# EAGLE design EEG1CH (EAGLE 9.4.2)
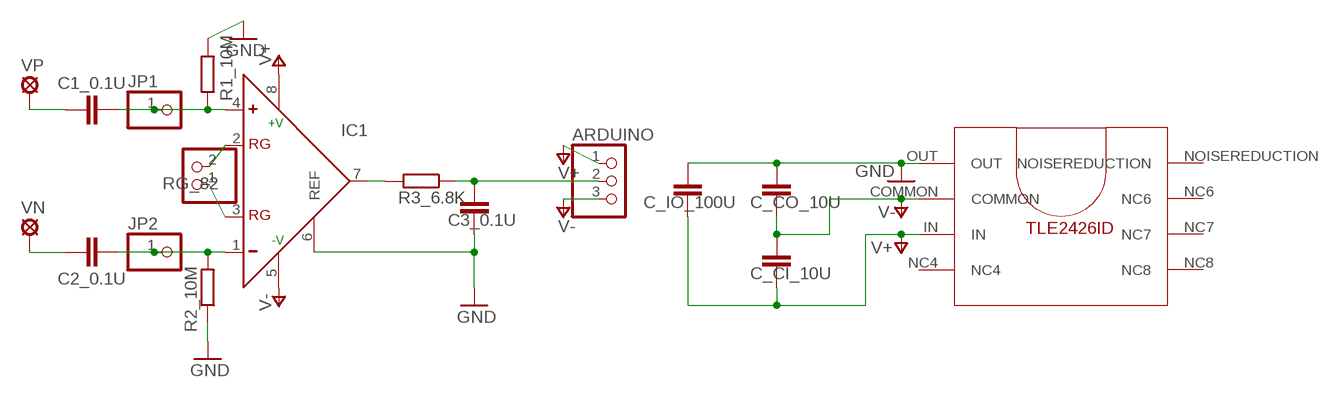
[diagram p0: schematic, sheet 1]

## Parts
ARDUINO  PINHD-1X3  [1X03]
C1_0.1U  C2,5-3  [C2.5-3]
C2_0.1U  C2,5-3  [C2.5-3]
C3_0.1U  C2,5-3  [C2.5-3]
C_CI_10U  C2,5-3  [C2.5-3]
C_CO_10U  C2,5-3  [C2.5-3]
C_IO_100U  C2,5-3  [C2.5-3]
IC1  AD8227  [SO8]
JP1  PINHD-1X1  [1X01]
JP2  PINHD-1X1  [1X01]
R1_10M  R-EU_R2012  [R2012]
R2_10M  R-EU_R2012  [R2012]
R3_6.8K  R-EU_R2012  [R2012]
RG_82  PINHD-1X2  [1X02]
U$1  TLE2426ID  [TLE2426ID]
VN  SE13  [SE13]
VP  SE13  [SE13]

## Nets
GND: C3_0.1U.2 C_CO_10U.1 C_IO_100U.1 IC1.6(REF) R1_10M.2 R2_10M.1 U$1.OUT
N$3: IC1.2(RG) RG_82.2
N$4: IC1.3(RG) RG_82.1
OUT-C-R: IC1.7(OUT) R3_6.8K.2
R-C-IN: C2_0.1U.2 IC1.1(-) JP2.1 R2_10M.2
R-C-IN2: C1_0.1U.2 IC1.4(+) JP1.1 R1_10M.1
R-VO: ARDUINO.2 C3_0.1U.1 R3_6.8K.1
V+: ARDUINO.1 C_CI_10U.2 C_IO_100U.2 IC1.8(+V) U$1.IN
V-: ARDUINO.3 C_CI_10U.1 C_CO_10U.2 IC1.5(-V) U$1.COMMON
VN-C: C2_0.1U.1 VN.MP
VP-C: C1_0.1U.1 VP.MP
Unconnected: U$1.NC4 U$1.NC6 U$1.NC7 U$1.NC8 U$1.NOISEREDUCTION

## Library data of the parts
ARDUINO = pinhead:PINHD-1X3: PIN HEADER
C1_0.1U C2_0.1U C3_0.1U C_CI_10U C_CO_10U C_IO_100U = capacitor-wima:C: CAPACITOR naming: grid - package width
IC1 = analog-devices:AD8227: Single-Supply, Rail-to-Rail, Low Cost Instrumentation Amplifier
JP1 JP2 = pinhead:PINHD-1X1: PIN HEADER
R1_10M R2_10M R3_6.8K = rcl:R-EU_: RESISTOR, European symbol; SPICEPREFIX: R
RG_82 = pinhead:PINHD-1X2: PIN HEADER
U$1 = TLE2426ID:TLE2426ID
VN VP = solpad:SE13: SOLDER PAD E1542, drill 1,3mm, distributor Buerklin, 07F815

## Board
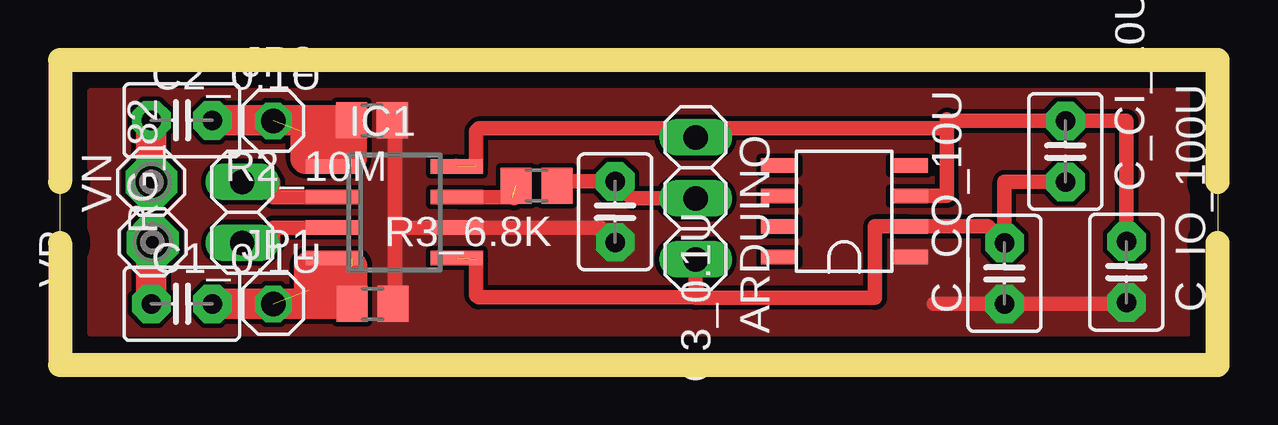
[diagram p1: board, top side]

Size 48.26 x 12.7 mm. Coordinates in mm from the lower left corner, seen from the top.
Outline: 48.26,0 0,0 0,12.7 48.26,12.7 48.26,0
Copper layers (1*16): Top 0.035mm / dielectric 1.5mm / Bottom 0.035mm
Design rules "default": minimum track width 6mil, minimum drill 0.35mm, track to track 6mil, track to pad 6mil, pad to pad 6mil, via to via 6mil, smd to smd 6mil, copper to edge 40mil, drill to drill 6mil, minimum pad ring 10mil, minimum via ring 8mil, stop-mask expansion 4mil, vias tented up to drill 0mil, thermal gap 10mil
Holes 0.5 mm at 0,5.08 0,7.62 48.26,7.62 48.26,5.08
Milling: 6 lines

### Footprints (pad centres in the part's own frame; a part is rotated, then mirrored left to right if it is on the bottom)
1X03 = drill 1.016 long: 1 -2.54,0; 2 0,0; 3 2.54,0
C2.5-3 = drill 0.813 pad 1.6 octagon: 1 -1.27,0; 2 1.27,0
SO8 = smd 0.6 x 2.2: 1 -1.905,-2.6; 2 -0.635,-2.6; 3 0.635,-2.6; 4 1.905,-2.6; 5 1.905,2.6; 6 0.635,2.6; 7 -0.635,2.6; 8 -1.905,2.6
1X01 = drill 1.016 octagon: 1 0,0
R2012 = smd 1.3 x 1.5: 1 -0.85,0; 2 0.85,0
1X02 = drill 1.016 long: 1 -1.27,0; 2 1.27,0
TLE2426ID = smd 1.549 x 0.61: COMMON -2.705,0.635; IN -2.705,-0.635; NC4 -2.705,-1.905; NC6 2.705,0.635; NC7 2.705,-0.635; NC8 2.705,-1.905; NOISEREDUCTION 2.705,1.905; OUT -2.705,1.905
SE13 = drill 1.321 pad 2.159 octagon: MP 0,0

### Placement (x,y rotation side)
ARDUINO  26.49,6.93 270 top
C1_0.1U  5.08,2.54 0 top
C2_0.1U  5.08,10.19 0 top
C3_0.1U  23.14,6.38 270 top
C_CI_10U  41.91,8.89 90 top
C_CO_10U  39.37,3.81 90 top
C_IO_100U  44.45,3.86 90 top
IC1  13.94,6.35 270 top
JP1  8.89,2.54 0 top
JP2  8.89,10.16 0 top
R1_10M  13.03,2.54 0 top
R2_10M  13,10.19 180 top
R3_6.8K  19.86,7.47 180 top
RG_82  7.59,6.35 90 top
U$1  32.69,6.4 180 top
VN  3.81,7.62 90 top
VP  3.86,5.11 90 top

### Tracks (layer width: path | path; a pad name or v marks a point on that pad's centre or on a via)
GND
  Top 0.61: 13.97,5.79 13.97,7.62 13.97,8.8 13.97,10.19 R2_10M.1 | 13.97,5.79 14.05,5.71 IC1.6 22.53,5.71 C3_0.1U.2 | 36.42,2.54 C_CO_10U.1 44.45,2.54 C_IO_100U.1 | 13.97,5.79 13.97,2.54 R1_10M.2
  pour Top (isolate 0.2, rank 6, no thermals): 1.27,11.43 46.99,11.43 46.99,1.27 1.27,1.27
N$3
  Top 0.61: IC1.2 8.89,6.99 8.89,7.62 RG_82.2
N$4
  Top 0.61: IC1.3 8.89,5.71 8.89,5.08 RG_82.1
OUT-C-R  (1 unrouted)
  Top 0.61: IC1.7 18.87,6.99 18.92,6.93
R-C-IN  (2 unrouted)
  Top 0.61: R2_10M.2 11.82,9.85 | 12.15,8.26 IC1.1
  Top 1.27: C2_0.1U.2 R2_10M.2 12.15,8.59 10.24,8.59 10.24,9.64 11.45,9.64
R-C-IN2  (2 unrouted)
  Top 0.61: 12.18,4.45 IC1.4
  Top 1.27: C1_0.1U.2 R1_10M.1 12.18,4.11 10.39,4.11 10.39,3.13 11.4,3.13
R-VO
  Top 0.61: R3_6.8K.1 20.89,7.64 C3_0.1U.1 23.85,6.93 ARDUINO.2
V+  (1 unrouted)
  Top 0.61: 16.51,8.29 IC1.8 | 17.35,8.28 17.35,9.73 17.47,9.85 26.12,9.85 ARDUINO.1 26.86,9.85 36.97,9.85 | C_IO_100U.2 44.45,10.16 C_CI_10U.2 36.97,10.16 | U$1.IN 36.97,7.04 36.97,9.85 | 36.97,9.85 36.97,10.16 | 36.97,10.16 36.97,10.22
V-  (1 unrouted)
  Top 0.61: 26.49,3.15 ARDUINO.3 26.49,2.79 33.97,2.79 33.97,5.77 U$1.COMMON 38.68,5.77 C_CO_10U.2 39.37,7.62 C_CI_10U.1 | 26.49,3.15 26.49,2.81 17.44,2.81 17.35,2.89 17.35,4.38 | 26.49,3.15 26.66,2.98
VN-C
  Top 1.27: VN.MP C2_0.1U.1
VP-C
  Top 1.27: VP.MP 3.81,5.05 C1_0.1U.1